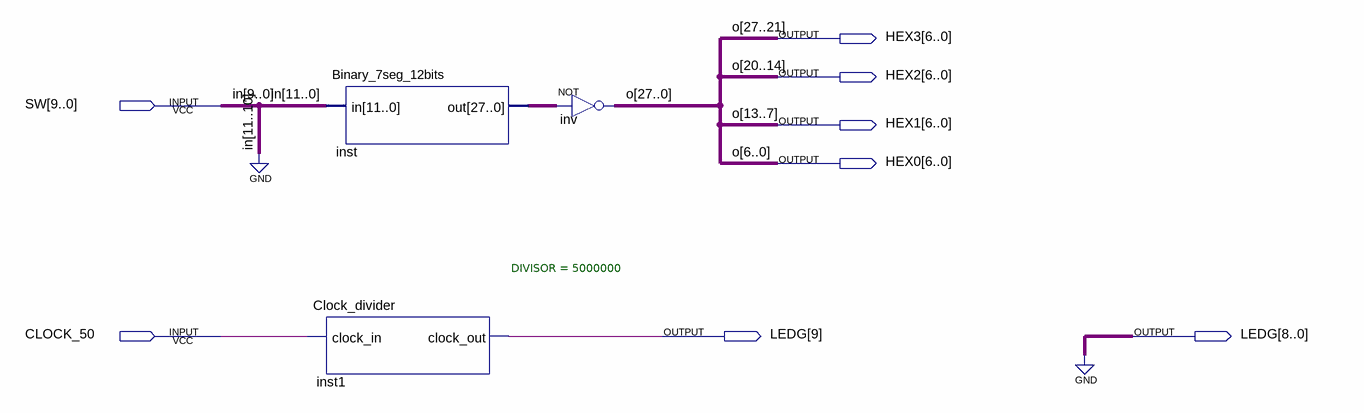
[diagram p0: schematic sheet]
// Quartus schematic Binary_7seg_12bit_BoardTest.bdf as structural Verilog: 3 symbols, 8 pins
module Binary_7seg_12bit_BoardTest (
  input  [9:0] SW,
  input  CLOCK_50,
  output [6:0] HEX3,
  output [6:0] HEX2,
  output [6:0] HEX1,
  output [6:0] HEX0,
  output [9:0] LEDG
);

  wire [27:0] inst_out;

  Binary_7seg_12bits inst (.in({2'b00, SW}), .out(inst_out));
  Clock_divider #(.DIVISOR(5000000)) inst1 (.clock_in(CLOCK_50), .clock_out(LEDG[9]));
  assign {HEX3, HEX2, HEX1, HEX0} = ~inst_out;  // NOT inv, 28 bits wide

  assign LEDG[8:0] = {9{1'b0}};

  // Other names for the same wires on the sheet: in[9:0] = SW; o[27:0] = {HEX3, HEX2, HEX1, HEX0}
endmodule
